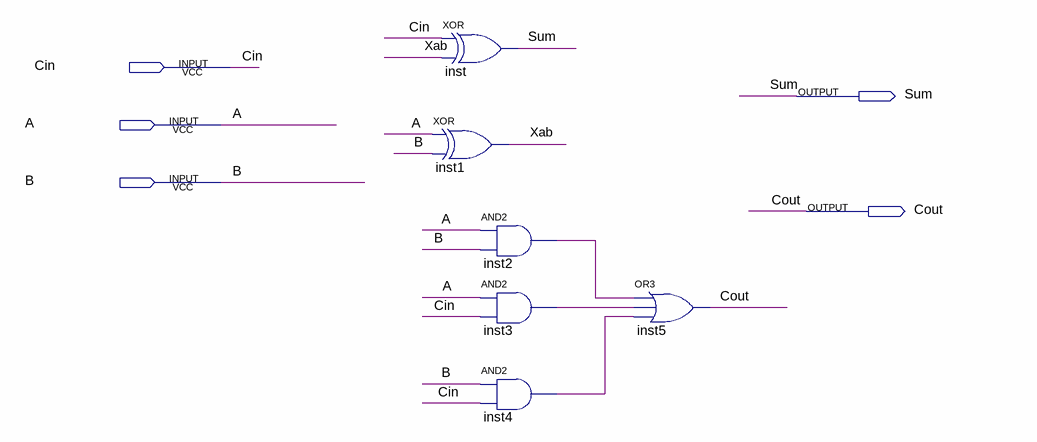
[diagram p0: schematic sheet]
// Quartus schematic adder.bdf as structural Verilog: 6 symbols, 5 pins
module adder (
  input  Cin,
  input  A,
  input  B,
  output Sum,
  output Cout
);

  wire inst2_out, inst3_out, inst4_out, Xab;

  xor inst (Sum, Cin, Xab);
  xor inst1 (Xab, A, B);
  and inst2 (inst2_out, A, B);
  and inst3 (inst3_out, A, Cin);
  and inst4 (inst4_out, B, Cin);
  or inst5 (Cout, inst2_out, inst3_out, inst4_out);
endmodule
